# EAGLE design Qwiic Distance Sensor - VCNL4040 (EAGLE 7.7.0)
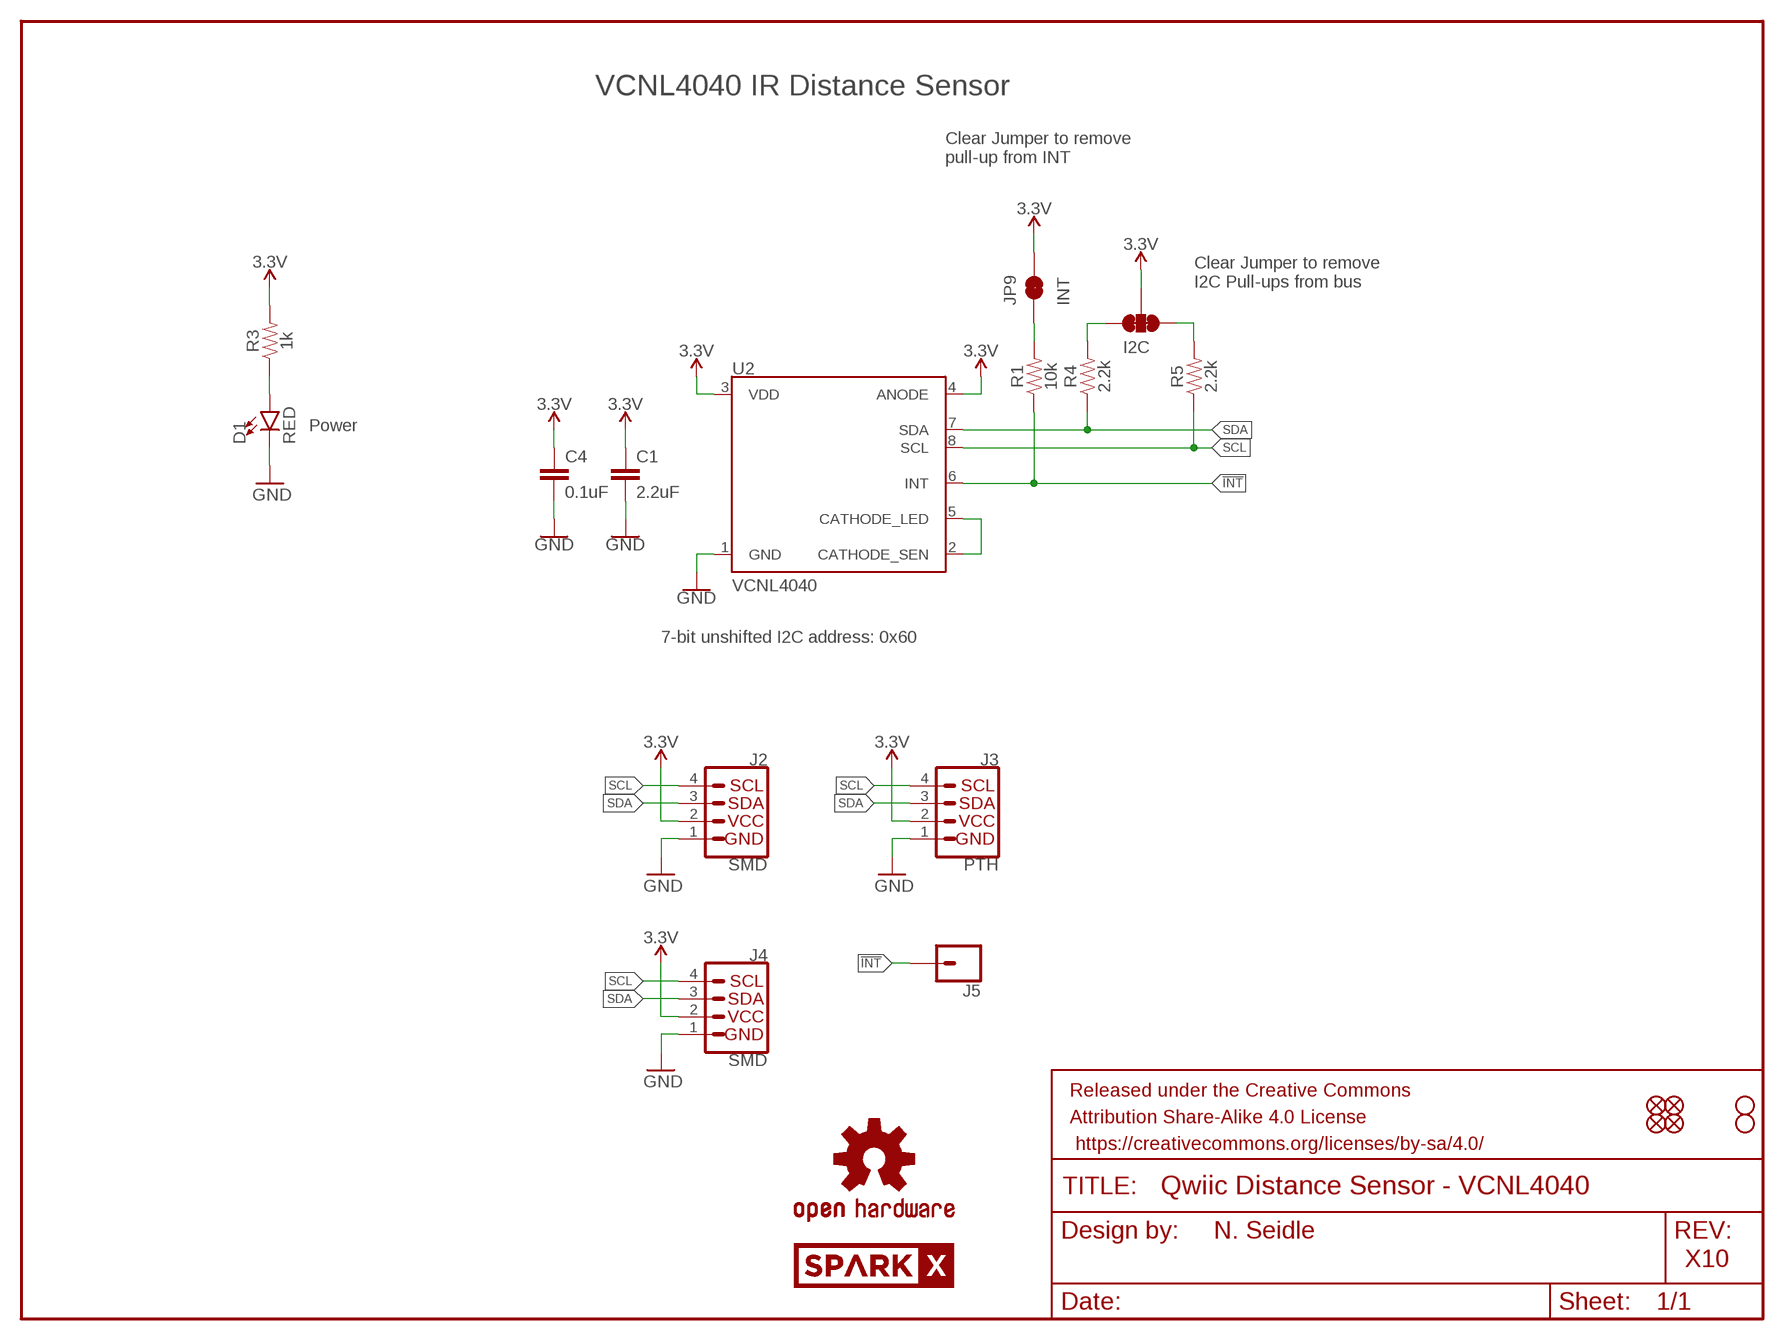
[diagram p0: schematic, sheet 1]

## Parts
C1  2.2uF  2.2UF-0603-10V-20%  [0603]
C4  0.1uF  0.1UF-0603-25V-(+80/-20%)  [0603]
D1  RED  LED-RED0603  [LED-0603]
FRAME1  FRAME-LETTER  [CREATIVE_COMMONS]
I2C  JUMPER-SMT_3_2-NC_TRACE_SILK  [SMT-JUMPER_3_2-NC_TRACE_SILK]
J2  SMD  I2C_STANDARDJS-1MM  [1X04_1MM_RA]
J3  PTH  I2C_STANDARD_NO_SILK  [1X04_NO_SILK]
J4  SMD  I2C_STANDARDJS-1MM  [1X04_1MM_RA]
J5  CONN_01PTH_NO_SILK_YES_STOP  [1X01_NO_SILK]
JP1  FIDUCIALUFIDUCIAL  [MICRO-FIDUCIAL]
JP2  FIDUCIALUFIDUCIAL  [MICRO-FIDUCIAL]
JP3  STAND-OFF  [STAND-OFF]
JP4  STAND-OFF  [STAND-OFF]
JP5  FIDUCIALUFIDUCIAL  [MICRO-FIDUCIAL]
JP6  FIDUCIALUFIDUCIAL  [MICRO-FIDUCIAL]
JP9  INT  JUMPER-PAD-2-NC_BY_TRACE  [PAD-JUMPER-2-NC_BY_TRACE_YES_SILK]
LOGO1  OSHW-LOGOMINI  [OSHW-LOGO-MINI]
R1  10k  10KOHM-0603-1/10W-1%  [0603]
R3  1k  1KOHM-0603-1/10W-1%  [0603]
R4  2.2k  2.2KOHM-0603-1/10W-1%  [0603]
R5  2.2k  2.2KOHM-0603-1/10W-1%  [0603]
U2  VCNL4040  [VCNL4040]
U$1  SPARKX-LOGO4  [SPARKX-MEDIUM]
U$2  SPARKX-LOGO4  [SPARKX-MEDIUM]

## Nets
3.3V: C1.1 C4.1 I2C.2 J2.2(VCC) J3.2(VCC) J4.2(VCC) JP9.2 R3.2 U2.3(VDD) U2.4(ANODE)
!INT: J5.1 R1.1 U2.6(INT)
GND: C1.2 C4.2 D1.C J2.1(GND) J3.1(GND) J4.1(GND) U2.1(GND)
N$1: I2C.1 R5.2
N$2: I2C.3 R4.2
N$3: D1.A R3.1
N$4: JP9.1 R1.2
N$6: U2.2(CATHODE_SEN) U2.5(CATHODE_LED)
SCL: J2.4(SCL) J3.4(SCL) J4.4(SCL) R5.1 U2.8(SCL)
SDA: J2.3(SDA) J3.3(SDA) J4.3(SDA) R4.1 U2.7(SDA)

## Notes on the sheet
- VCNL4040 IR Distance Sensor
- Clear Jumper to remove 
  pull-up from INT
- Clear Jumper to remove 
  I2C Pull-ups from bus
- Power
- 7-bit unshifted I2C address: 0x60
- N. Seidle
- X10

## Library data of the parts
C1 = SparkFun-Capacitors:2.2UF: 2.2µF ceramic capacitors A capacitor is a passive two-terminal electrical component used to store electrical energy temporarily in an electric field.; PROD_ID: CAP-07888
C4 = SparkFun-Capacitors:0.1UF: 0.1µF ceramic capacitors A capacitor is a passive two-terminal electrical component used to store electrical energy temporarily in an electric field.; PROD_ID: CAP-00810
D1 = SparkFun-LED:LED-RED: Red SMD LED Used in manufacturing of most products at SparkFun Packages: 0603 - SMD 0603 package [Product Link] <http://docs.avagotech.com/docs/AV02-0551EN> 0603 SMART - SMD 0603 SMART package ( more efficient and expensive)[Product Link] <http://www.osram-os.com/Graphics/XPic2/00077099_0.pdf> 1206 - SMD1206 package [Product Link] <https://www.sparkfun.com/datasheets/DevTools/LilyPad/Q150OVS4.pdff> SparkFun Products: Pro Mini 328 -5V <https://www.sparkfun.com/products/821> RedBoard <https://www.sparkfun.com/products/12757> IOIO-OTG <https://www.sparkfun.com/products/13613>; PROD_ID: DIO-00819
FRAME1 = SparkFun-Aesthetics:FRAME-LETTER: Schematic Frame - Letter Standard 8.5x11 US Letter frame
I2C = SparkFun-Jumpers:JUMPER-SMT_3_2-NC_TRACE: Normally closed trace jumper (2 of 2 connections) This jumper has a trace between all three pads so they are normally closed (NC). Use a razor knife to open the connection(s). For best results follow the IPC guidelines for cutting traces: Cutout at least 0.063 mm (0.005 in). Remove all loose material to clean up the cut area. Seal the cut with an approved epoxy. Reapply solder to reclose the connection(s).
J2-J4 = SparkX:I2C_STANDARD: SparkFun I2C Standard Pinout Header SparkFun has standardized on a pinout for all I2C based sensor breakouts. This pinout allows I2C boards to be plugged directly into the headers on Arduino Uno compatible boards, and to be daisy chained easily. Example SparkFun Products: SparkFun Atmospheric Sensor Breakout - BME280 <https://www.sparkfun.com/products/13676> SparkFun Altitude/Pressure Sensor Breakout - MPL3115A2 <https://www.sparkfun.com/products/11084> SparkFun TOF Range Finder Sensor - VL6180 <https://www.sparkfun.com/products/12785>
J5 = SparkFun-Connectors:CONN_01: Single connection point. Often used as Generic Header-pin footprint for 0.1 inch spaced/style header connections On any of the 0.1 inch spaced packages, you can populate with these: Break Away Headers - Straight <https://www.sparkfun.com/products/116> (PRT-00116) Break Away Male Headers - Right Angle <https://www.sparkfun.com/products/553> (PRT-00553) Female Headers <https://www.sparkfun.com/products/115> (PRT-00115) Break Away Headers - Machine Pin <https://www.sparkfun.com/products/117> (PRT-00117) Break Away Female Headers - Swiss Machine Pin <https://www.sparkfun.com/products/743> (PRT-00743) This device is also useful as a general connection point to wire up your design to another part of your project. Our various solder wires solder well into these plated through hole pads. Hook-Up Wire - Assortment (Stranded, 22 AWG) <https://www.sparkfun.com/products/11375> (PRT-11375) Hook-Up Wire - Assortment (Solid Core, 22 AWG) <https://www.sparkfun.com/products/11367> (PRT-11367) View the entire wire category on our website here <https://www.sparkfun.com/categories/141> Special notes: SMTSO-256-ET is a "flush mount" nut for a 4-40 screw. We mostly use this on specialty testbeds; it is a nice way to connect hardware to your PCB at an adjustable hieght. Also note, the SNAP packages are for using a snappable style connector. We sell a baggie of snaps and they are also used on two LilyPad designs: Snap Assortment - 30 pack (male and female) <https://www.sparkfun.com/products/11347> (DEV-11347) LilyPad Arduino SimpleSnap <https://www.sparkfun.com/products/10941> (DEV-10941) LilyPad SimpleSnap Protoboard <https://www.sparkfun.com/products/10940> (DEV-10940)
JP1 JP2 JP5 JP6 = SparkFun:FIDUCIAL: Fiducial Alignment Points Various fiducial points for machine vision alignment.
JP3 JP4 = SparkFun:STAND-OFF: Stand Off This is the mechanical footprint for a #4 phillips button head screw. Use the keepout ring to avoid running the screw head into surrounding components. SKU : PRT-00447
JP9 = SparkFun-Passives:JUMPER-PAD-2-NC_BY_TRACE
LOGO1 = SparkFun-Aesthetics:OSHW-LOGO: Open-Source Hardware (OSHW) Logo This logo indicates the piece of hardware it is found on incorporates a OSHW license and/or adheres to the definition of open source hardware found here: http://freedomdefined.org/OSHW
R1 = SparkFun-Resistors:10KOHM: 10kΩ resistor A resistor is a passive two-terminal electrical component that implements electrical resistance as a circuit element. Resistors act to reduce current flow, and, at the same time, act to lower voltage levels within circuits. - Wikipedia; PROD_ID: RES-00824
R3 = SparkFun-Resistors:1KOHM: 1kΩ resistor A resistor is a passive two-terminal electrical component that implements electrical resistance as a circuit element. Resistors act to reduce current flow, and, at the same time, act to lower voltage levels within circuits. - Wikipedia; PROD_ID: RES-07856
R4 R5 = SparkFun-Resistors:2.2KOHM: 2.2kΩ resistor A resistor is a passive two-terminal electrical component that implements electrical resistance as a circuit element. Resistors act to reduce current flow, and, at the same time, act to lower voltage levels within circuits. - Wikipedia; PROD_ID: RES-08272
U2 = SparkX:VCNL4040
U$1 U$2 = SparkX:SPARKX-LOGO

## Net classes
1 power: width 0.203 mm

## Board
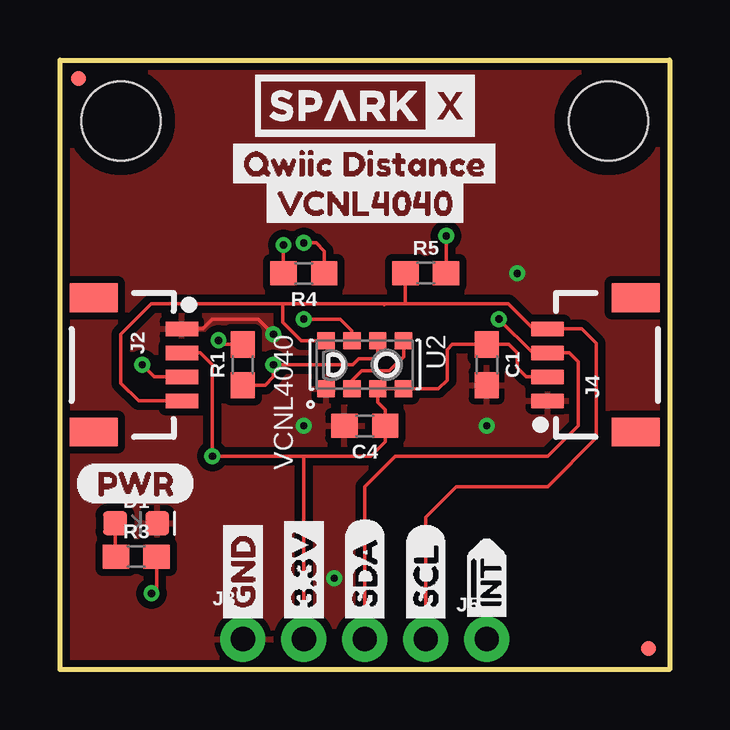
[diagram p1: board, top side]
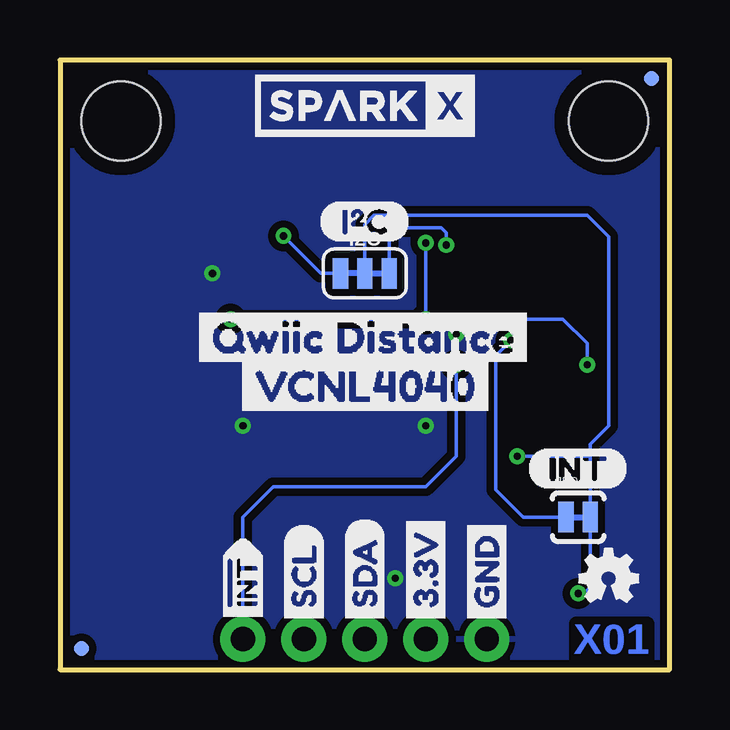
[diagram p2: board, bottom side, seen from below]

Size 25.4 x 25.4 mm. Coordinates in mm from the lower left corner, seen from the top.
Outline: 0,0 0,25.4 25.4,25.4 25.4,0 0,0
Copper layers (1*16): Top 0.035mm / dielectric 1.5mm / Bottom 0.035mm
Design rules "SparkFun-2-layer-PCBWay-LIMIT": minimum track width 6mil, minimum drill 0.3mm, track to track 6mil, track to pad 6mil, pad to pad 6mil, via to via 6mil, smd to smd 6mil, copper to edge 6mil, drill to drill 6mil, minimum pad ring 7mil, minimum via ring 7mil, stop-mask expansion 4mil, vias tented up to drill 25mil, thermal gap 10mil

### Footprints (pad centres in the part's own frame; a part is rotated, then mirrored left to right if it is on the bottom)
0603 = smd 1.1 x 1: 1 -0.85,0; 2 0.85,0
LED-0603 = smd 1 x 1: A -0.877,0; C 0.877,0
SMT-JUMPER_3_2-NC_TRACE_SILK = smd 0.635 x 1.27: 1 -1.016,0; 2 0,0; 3 1.016,0
1X04_1MM_RA = smd 0.6 x 1.35: 1 -1.5,0; 2 -0.5,0; 3 0.5,0; 4 1.5,0 | smd 1.2 x 2: NC1 2.8,-3.675; NC2 -2.8,-3.675
1X04_NO_SILK = drill 1.016 pad 1.88: 1 0,0; 2 2.54,0; 3 5.08,0; 4 7.62,0
1X01_NO_SILK = drill 1.016 pad 1.88: 1 0,0
MICRO-FIDUCIAL = smd 0.635 x 0.635: 1 0,0
STAND-OFF = hole 3.302: 0,0
PAD-JUMPER-2-NC_BY_TRACE_YES_SILK = smd 0.635 x 1.27: 1 -0.508,0; 2 0.508,0
VCNL4040 = smd 0.7 x 0.725: 1 1,-1.613; 2 1,-0.537; 3 1,0.537; 4 1,1.613; 5 -1,1.613; 6 -1,0.537; 7 -1,-0.537; 8 -1,-1.613

### Placement (x,y rotation side)
C1  17.78,12.7 270 top
C4  12.7,10.16 180 top
D1  3.17,6.1 0 top
FRAME1  -20.32,-17.78 0 top  (outside the outline)
I2C  12.7,16.51 0 bottom
J2  5.08,12.7 270 top
J3  7.62,1.27 0 top
J4  20.32,12.7 90 top
J5  17.78,1.27 0 top
JP1  0.76,24.64 0 bottom
JP2  24.51,0.89 0 top
JP3  2.54,22.86 0 top
JP4  22.86,22.86 0 top
JP5  24.51,0.89 0 bottom
JP6  0.76,24.64 0 top
JP9  3.81,6.35 0 bottom
LOGO1  2.54,3.81 0 bottom
R1  7.62,12.7 90 top
R3  3.17,4.7 0 top
R4  10.16,16.51 180 top
R5  15.24,16.51 0 top
U2  12.7,12.7 270 top
U$1  12.7,23.5 0 top
U$2  12.7,23.5 0 bottom
U$3  [GND1]  7.62,1.65 90 bottom
U$4  [3#3V2]  10.16,1.65 90 bottom
U$5  [SDA8]  12.7,1.65 90 bottom
U$6  [SCL9]  15.24,1.65 90 bottom
U$7  [#INT14]  17.78,1.52 90 bottom
U$10  [(PWR)]  0.64,7.75 0 top
U$11  [(I_SUPER2_C)]  14.61,18.67 0 bottom
U$12  [(INT)]  5.97,8.38 0 bottom
U$13  [VCNL40400]  8.13,19.43 0 top
U$14  [VCNL40401]  18.41,11.81 0 bottom
U$15  [QWIIC_DISTANCE7]  20.19,13.84 0 bottom
U$19  [QWIIC_DISTANCE9]  6.73,21.08 0 top
U$21  [3#3V2]  10.16,1.65 90 top
U$22  [GND1]  7.62,1.65 90 top
U$25  [#INT14]  17.78,1.52 90 top
U$26  [SCL9]  15.24,1.65 90 top
U$27  [SDA8]  12.7,1.65 90 top

### Tracks (layer width: path | path; a pad name or v marks a point on that pad's centre or on a via)
3.3V  (via drill 0.3)
  Top 0.152: J4.2 19.42,12.2 19.05,12.57 19.05,13.21 18.71,13.55 C1.1 16.34,13.55 16.13,13.34 16.13,12.06 15.76,11.7 U2.4 U2.3 13.24,11.15 13.55,10.83 C4.1 13.55,9.49 12.95,8.89 10.16,8.89 | J2.2 5.85,13.2 6.35,12.7 v6.35,8.89 10.16,8.89 | R3.2 4.03,3.39 v3.81,3.17 | J3.2 10.16,8.89
  Bottom 0.152: 3.3,8.89 JP9.2 3.3,3.43 3.56,3.17 v3.81,3.17 | 3.3,8.89 3.3,9.4 2.54,10.16 2.54,18.03 3.43,18.92 12.32,18.92 12.7,18.54 I2C.2 | v6.35,8.89 3.3,8.89
!INT  (via drill 0.3)
  Top 0.152: R1.1 8.55,11.85 8.89,12.19 v8.89,12.7 12.19,12.7 12.45,12.95 13.08,12.95 13.24,13.11 U2.6
  Bottom 0.152: J5.1 17.78,6.35 16.51,7.62 10.16,7.62 8.89,8.89 v8.89,12.7
GND  (via drill 0.3)
  Top 0.152: J2.1 5.95,14.2 6.35,14.61 8.26,14.61 v8.89,13.97
  other vias: 17.78,10.16 11.43,3.81 19.05,16.51 10.16,10.16
  pour Bottom (isolate 0.305): 0,0 0,25.4 25.4,25.4 25.4,0
  pour Top (isolate 0.305): 0,0 0,25.4 25.4,25.4 25.4,0
N$1  (via drill 0.3)
  Top 0.152: R5.2 v16.09,18.07
  Bottom 0.152: I2C.1 14.53,16.51 v16.09,18.07
N$2  (via drill 0.3)
  Top 0.152: R4.2 v9.31,17.69
  Bottom 0.152: I2C.3 11.68,18.16 11.43,18.41 9.53,18.41 9.31,18.2 v9.31,17.69
N$3
  Top 0.152: D1.A 2.3,4.73 R3.1
N$4  (via drill 0.3)
  Top 0.152: R1.2 6.77,13.55 v6.6,13.72
  Bottom 0.152: 6.86,13.46 v6.6,13.72 7.24,13.08 7.24,7.49 6.1,6.35 JP9.1
N$6
  Top 0.152: U2.5 14.31,13.04 13.72,12.45 12.57,12.45 12.16,12.04 U2.2
SCL
  Top 0.152: 14.35,15.24 18.67,15.24 19.71,14.2 J4.4 21.74,14.2 22.35,13.59 22.35,9.65 20.32,7.62 16.51,7.62 15.24,6.35 J3.4 | 14.35,15.24 13.46,15.24 | 13.46,15.24 9.27,15.24 | 9.27,15.24 3.81,15.24 2.54,13.97 2.54,11.94 3.28,11.2 J2.4 | 13.5,15.2 13.46,15.24 | R5.1 14.39,15.28 14.35,15.24 | U2.8 10.05,13.7 9.27,14.48 9.27,15.24
SDA  (via drill 0.3)
  Top 0.152: v18.29,14.61 19.69,13.2 J4.3 21.22,13.2 21.59,12.83 21.59,10.16 20.32,8.89 13.97,8.89 12.7,7.62 J3.3 | J2.3 3.93,12.2 v3.43,12.7 | R4.1 11.01,17.44 10.67,17.78 v10.16,17.78 | v10.16,14.61 11.68,14.61 12.16,14.13 U2.7
  Bottom 0.152: v3.43,12.7 3.43,13.59 4.45,14.61 v10.16,14.61 | v18.29,14.61 v10.16,14.61 | v10.16,17.78 v10.16,14.61

### Text on the board
Bottom: X01